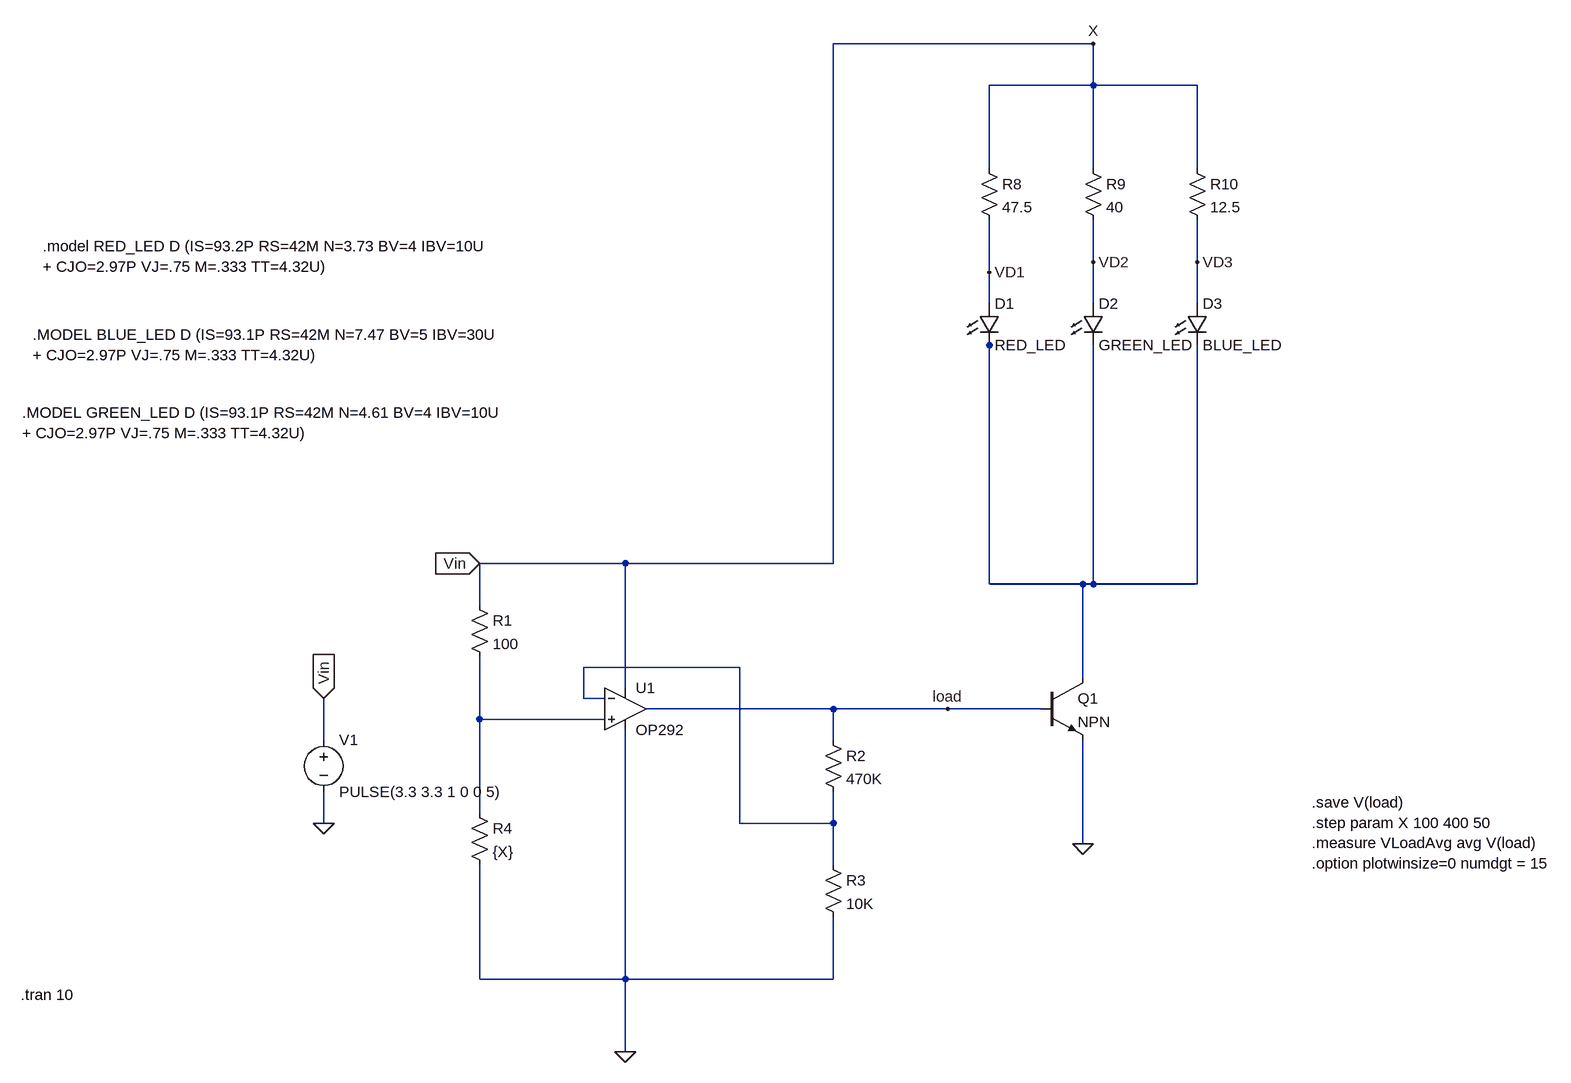
[diagram p0: schematic OpAmp Circuit2.asc]
OpAmp Circuit2.asc, the LTspice schematic file:
Version 4
SHEET 1 1840 680
WIRE 880 -960 480 -960
WIRE 880 -896 880 -960
WIRE 880 -896 720 -896
WIRE 1040 -896 880 -896
WIRE 720 -768 720 -896
WIRE 880 -768 880 -896
WIRE 1040 -768 1040 -896
WIRE 880 -624 880 -688
WIRE 1040 -624 1040 -688
WIRE 720 -608 720 -688
WIRE 720 -560 720 -608
WIRE 880 -560 880 -624
WIRE 1040 -560 1040 -624
WIRE 720 -496 720 -512
WIRE 160 -160 -64 -160
WIRE 480 -160 480 -960
WIRE 480 -160 160 -160
WIRE 720 -128 720 -496
WIRE 864 -128 720 -128
WIRE 880 -128 880 -496
WIRE 880 -128 864 -128
WIRE 1040 -128 1040 -496
WIRE 1040 -128 880 -128
WIRE -64 -96 -64 -160
WIRE 336 0 96 0
WIRE 864 16 864 -128
WIRE 160 32 160 -160
WIRE 96 48 96 0
WIRE 128 48 96 48
WIRE 480 64 192 64
WIRE 656 64 480 64
WIRE 800 64 656 64
WIRE -64 80 -64 -16
WIRE 128 80 -64 80
WIRE -304 112 -304 48
WIRE 480 112 480 64
WIRE -64 224 -64 80
WIRE -304 240 -304 192
WIRE 336 240 336 0
WIRE 480 240 480 192
WIRE 480 240 336 240
WIRE 864 272 864 112
WIRE 480 304 480 240
WIRE -64 480 -64 304
WIRE 160 480 160 96
WIRE 160 480 -64 480
WIRE 480 480 480 384
WIRE 480 480 160 480
WIRE 160 592 160 480
FLAG -64 -160 Vin
IOPIN -64 -160 In
FLAG -304 48 Vin
IOPIN -304 48 In
FLAG -304 240 0
FLAG 720 -608 VD1
FLAG 880 -624 VD2
FLAG 1040 -624 VD3
FLAG 864 272 0
FLAG 880 -960 X
FLAG 160 592 0
FLAG 656 64 load
SYMBOL res -80 -112 R0
SYMATTR InstName R1
SYMATTR Value 100
SYMBOL res 464 96 R0
SYMATTR InstName R2
SYMATTR Value 470K
SYMBOL res 464 288 R0
SYMATTR InstName R3
SYMATTR Value 10K
SYMBOL res -80 208 R0
SYMATTR InstName R4
SYMATTR Value {X}
SYMBOL voltage -304 96 R0
WINDOW 123 0 0 Left 0
WINDOW 39 0 0 Left 0
SYMATTR InstName V1
SYMATTR Value PULSE(3.3 3.3 1 0 0 5)
SYMBOL res 704 -784 R0
SYMATTR InstName R8
SYMATTR Value 47.5
SYMBOL res 864 -784 R0
SYMATTR InstName R9
SYMATTR Value 40
SYMBOL res 1024 -784 R0
SYMATTR InstName R10
SYMATTR Value 12.5
SYMBOL LED 704 -560 R0
SYMATTR InstName D1
SYMATTR Value RED_LED
SYMBOL LED 864 -560 R0
SYMATTR InstName D2
SYMATTR Value GREEN_LED
SYMBOL LED 1024 -560 R0
SYMATTR InstName D3
SYMATTR Value BLUE_LED
SYMBOL npn 800 16 R0
SYMATTR InstName Q1
SYMBOL OpAmps\\OP292 160 0 R0
SYMATTR InstName U1
TEXT -736 -648 Left 2 !.model RED_LED D (IS=93.2P RS=42M N=3.73 BV=4 IBV=10U\n+ CJO=2.97P VJ=.75 M=.333 TT=4.32U)
TEXT -752 -512 Left 2 !.MODEL BLUE_LED D (IS=93.1P RS=42M N=7.47 BV=5 IBV=30U\n+ CJO=2.97P VJ=.75 M=.333 TT=4.32U)
TEXT -768 -392 Left 2 !.MODEL GREEN_LED D (IS=93.1P RS=42M N=4.61 BV=4 IBV=10U\n+ CJO=2.97P VJ=.75 M=.333 TT=4.32U)
TEXT -770 504 Left 2 !.tran 10
TEXT 1216 208 Left 2 !.save V(load)\n.step param X 100 400 50\n.measure VLoadAvg avg V(load) \n.option plotwinsize=0 numdgt = 15

The netlist it stands for:
* OpAmp Circuit2.asc
R1 X N003 100
R2 load N002 470K
R3 N002 0 10K
R4 N003 0 {X}
V1 X 0 PULSE(3.3 3.3 1 0 0 5)
R8 X VD1 47.5
R9 X VD2 40
R10 X VD3 12.5
D1 VD1 N001 RED_LED
D2 VD2 N001 GREEN_LED
D3 VD3 N001 BLUE_LED
Q1 N001 load 0 0 NPN
XU1 N003 N002 X 0 load OP292  ; pins In+ In- V+ V- OUT
.model D D
.lib standard.dio
.model NPN NPN
.model PNP PNP
.lib standard.bjt
.model RED_LED D (IS=93.2P RS=42M N=3.73 BV=4 IBV=10U
+ CJO=2.97P VJ=.75 M=.333 TT=4.32U)
.MODEL BLUE_LED D (IS=93.1P RS=42M N=7.47 BV=5 IBV=30U
+ CJO=2.97P VJ=.75 M=.333 TT=4.32U)
.MODEL GREEN_LED D (IS=93.1P RS=42M N=4.61 BV=4 IBV=10U
+ CJO=2.97P VJ=.75 M=.333 TT=4.32U)
.tran 10
.save V(load)
.step param X 100 400 50
.measure VLoadAvg avg V(load)
.option plotwinsize=0 numdgt = 15
.lib ADI1.lib
.backanno
.end